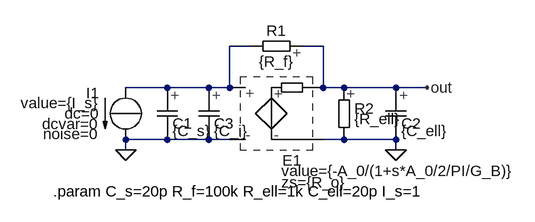
[diagram p0: schematic transimpedanceSelectGB.asc]
transimpedanceSelectGB.asc, the LTspice schematic file:
Version 4
SHEET 1 880 680
WIRE 176 48 144 48
WIRE 288 48 256 48
WIRE 48 112 -16 112
WIRE 112 112 48 112
WIRE 144 112 144 48
WIRE 144 112 112 112
WIRE 288 112 288 48
WIRE 320 112 288 112
WIRE 400 112 320 112
WIRE 448 112 400 112
WIRE 48 192 -16 192
WIRE 112 192 48 192
WIRE 144 192 112 192
WIRE 320 192 288 192
WIRE 400 192 320 192
WIRE -16 208 -16 192
WIRE 400 208 400 192
FLAG -16 208 0
FLAG 448 112 out
FLAG 400 208 0
SYMBOL SLC 48 112 R0
SYMATTR InstName C1
SYMATTR Value {C_s}
SYMBOL SLI -16 112 M0
SYMATTR InstName I1
SYMATTR Value value={I_s}
SYMBOL SLR 320 112 R0
SYMATTR InstName R2
SYMATTR Value {R_ell}
SYMBOL SLC 400 112 R0
SYMATTR InstName C2
SYMATTR Value {C_ell}
SYMBOL SLR 256 48 R90
WINDOW 0 -8 40 VBottom 2
WINDOW 3 8 40 VTop 2
SYMATTR InstName R1
SYMATTR Value {R_f}
SYMBOL SLEZ 224 96 R0
WINDOW 0 1 128 Left 2
WINDOW 3 0 144 Left 2
WINDOW 123 0 162 Left 2
SYMATTR InstName E1
SYMATTR Value value={-A_0/(1+s*A_0/2/PI/G_B)}
SYMATTR Value2 zs={R_o}
SYMBOL SLC 112 112 R0
SYMATTR InstName C3
SYMATTR Value {C_i}
TEXT -128 272 Left 2 !.param C_s=20p R_f=100k R_ell=1k C_ell=20p I_s=1

The netlist it stands for:
* transimpedanceSelectGB.asc
C1 N001 0 {C_s}
I1 N001 0 I value={I_s} dc=0 dcvar=0 noise=0
R2 out 0 {R_ell}
C2 out 0 {C_ell}
R1 out N001 {R_f}
E1 out 0 N001 0 EZ value={-A_0/(1+s*A_0/2/PI/G_B)} zs={R_o}
C3 N001 0 {C_i}
.param C_s=20p R_f=100k R_ell=1k C_ell=20p I_s=1
.backanno
.end